# Altium schematic sheet [01] - TK2560_CoverPage.SchDoc
size A3; DocumentNumber: 1; SheetNumber: 1; SheetTotal: 15
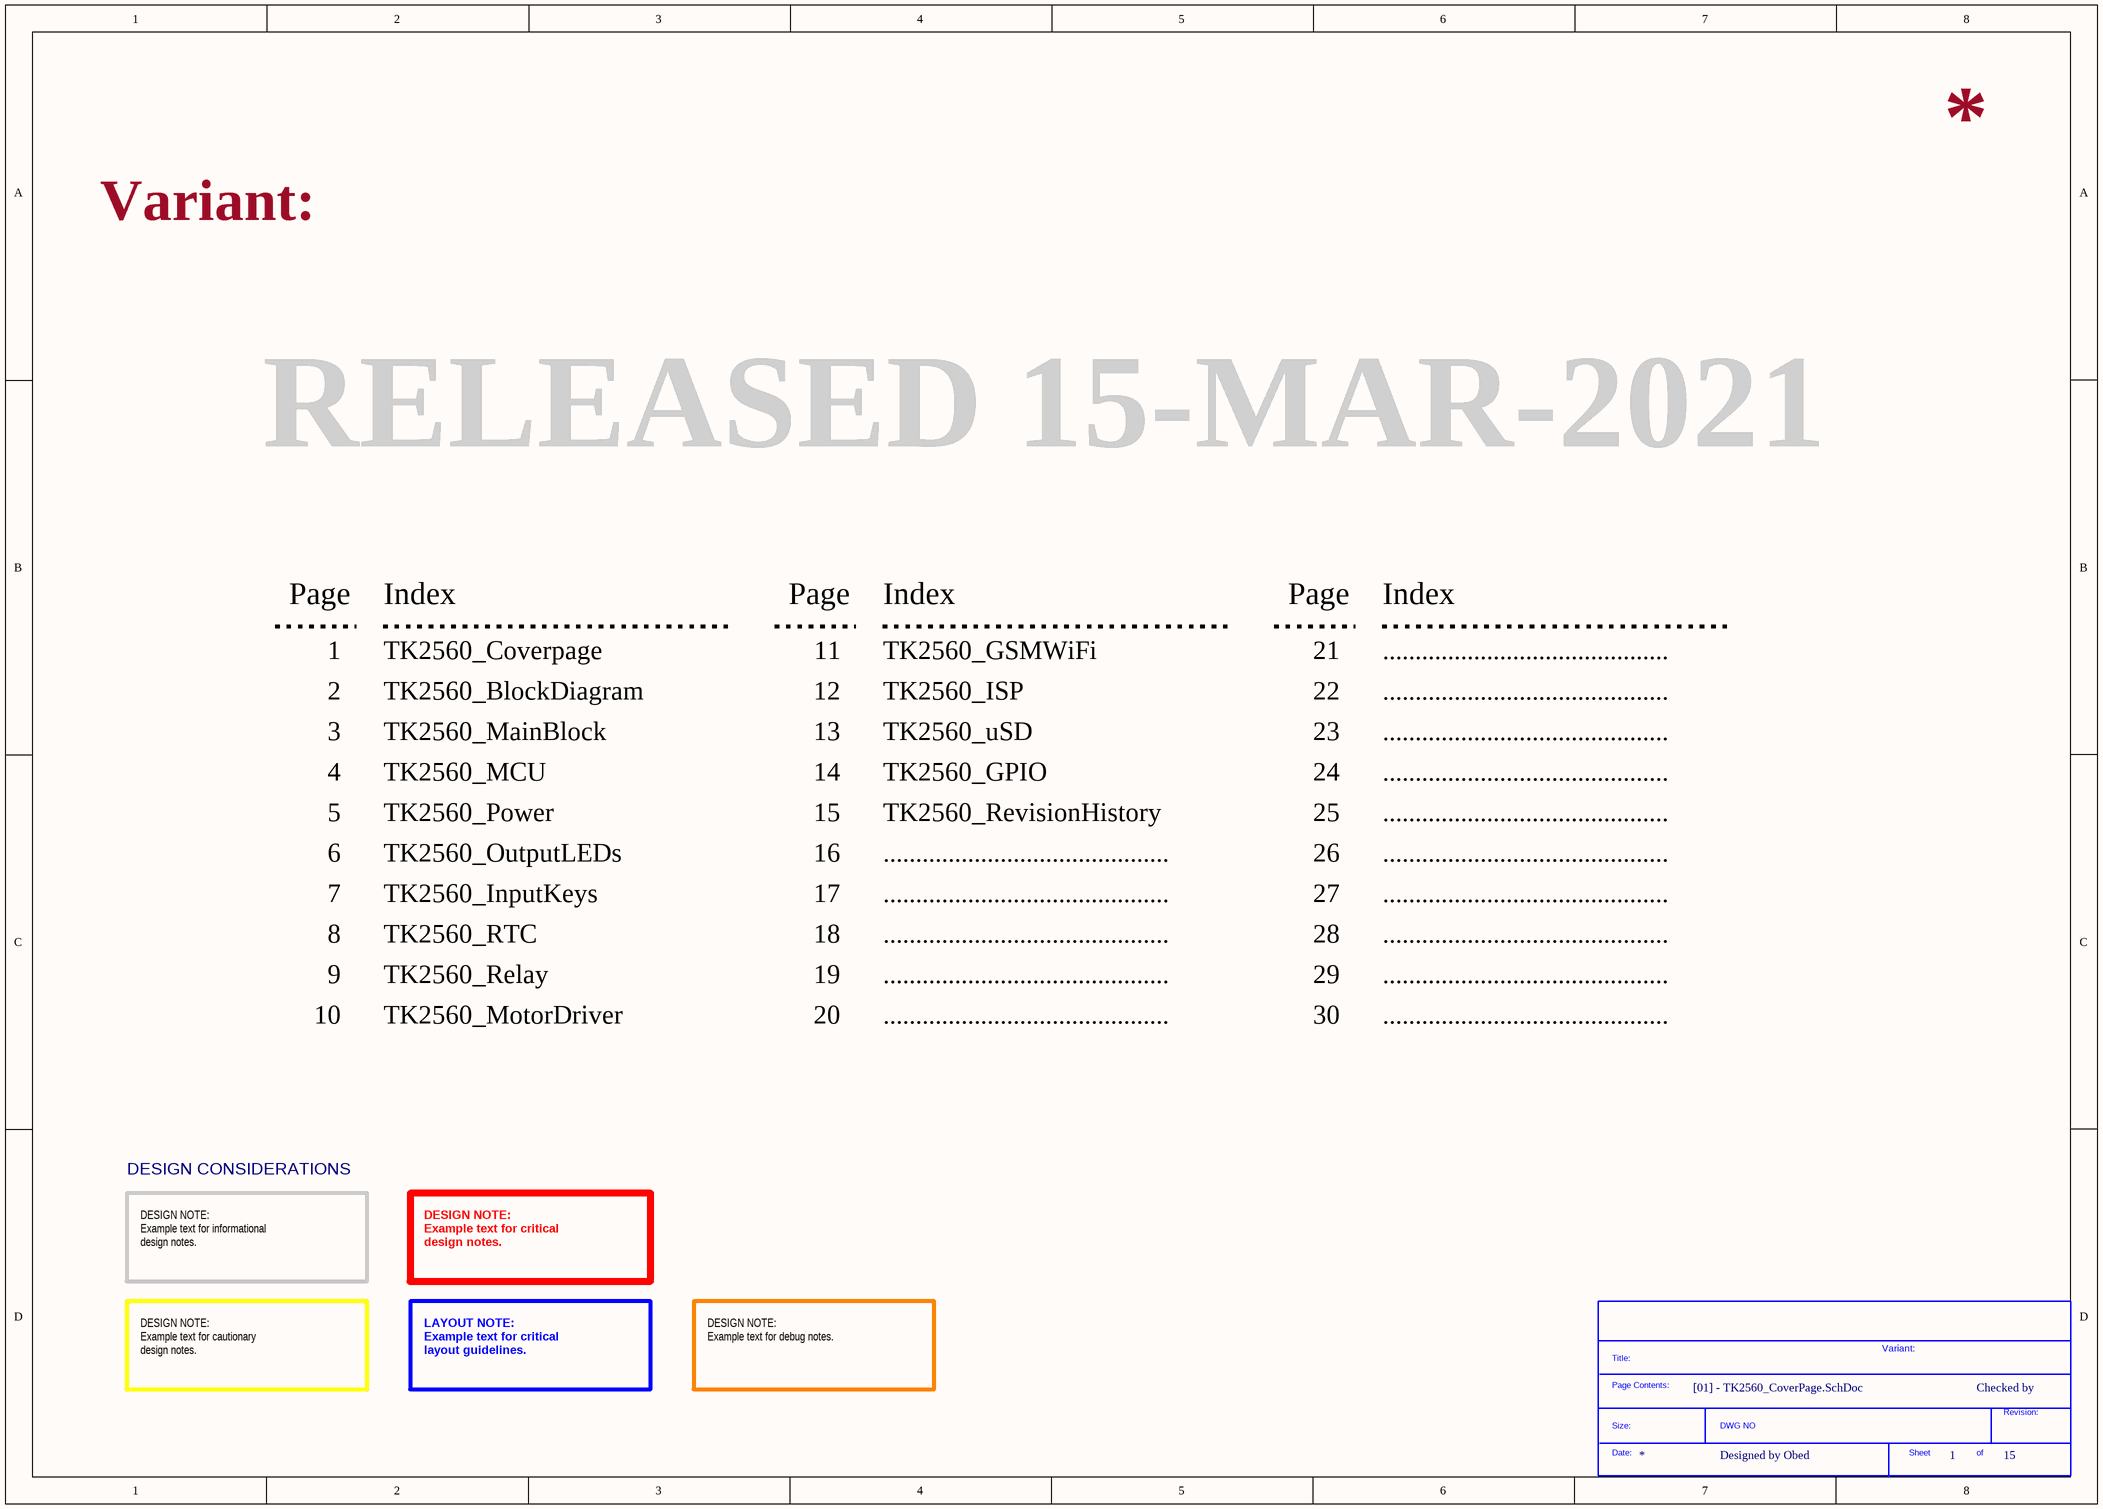
[diagram p0: [01] - TK2560_CoverPage.SchDoc]

## Parts
*  SDTitleBlock  (value not drawn)  (graphical)

## Notes on the sheet
- Variant:
- RELEASED 15-MAR-2021
- Page
- Index
- 1
- 2
- TK2560_Coverpage
- TK2560_BlockDiagram
- 11
- 12
- TK2560_GSMWiFi
- TK2560_ISP
- 21
- 22
- ............................................
- 3
- 4
- TK2560_MainBlock
- TK2560_MCU
- 13
- 14
- TK2560_uSD
- TK2560_GPIO
- 23
- 24
- 5
- TK2560_Power
- 15
- TK2560_RevisionHistory
- 25
- 6
- 7
- TK2560_OutputLEDs
- TK2560_InputKeys
- 16
- 17
- 26
- 27
- 8
- 9
- TK2560_RTC
- TK2560_Relay
- 18
- 19
- 28
- 29
- 10
- TK2560_MotorDriver
- 20
- 30
- DESIGN CONSIDERATIONS
- DESIGN NOTE:
  Example text for informational
  design notes.
- DESIGN NOTE:
  Example text for critical
  design notes.
- DESIGN NOTE:
  Example text for cautionary
  design notes.
- LAYOUT NOTE:
  Example text for critical
  layout guidelines.
- DESIGN NOTE:
  Example text for debug notes.
- Checked by
- Designed by Obed
- (in symbol SDTitleBlock) Title:; Page Contents:; Revision:; Size:; DWG NO; Date:; Sheet; of